# Altium schematic sheet LionIRVT-TM4C_Power.SchDoc
size A4; Date: Not shown in title block; ApprovedBy: Not shown in title block; CheckedBy: Not shown in title block; Author: Not shown in title block; CompanyName: Not shown in title block; Engineer: Not shown in title block; Organization: Not shown in title block; Address1: Not shown in title block; Address2: Not shown in title block; Address3: Not shown in title block; Address4: Not shown in title block; DocumentNumber: 11; Revision: Use project parameter SCH_Rev; SheetNumber: 11; SheetTotal: 11; PageSetup: Record=PageOptions|CenterHorizontal=True|CenterVertical=True|PrintScale=1.00|XCorrection=1.00|YCorrection=1.00|PrintKind=0|BorderSize=5000000|LeftOffset=0|BottomOffset=0|Orientation=2|PaperLength=1000|PaperWidth=1000|Scale=100|PaperSource=15|PrintQuality=600|MediaType=1|DitherType=10|PaperKind=Letter|PrintScaleMode=1; CurrentTime: Not shown in title block; CurrentDate: Not shown in title block; Time: Not shown in title block; DocumentFullPathAndName: Not shown in title block; DocumentName: Not shown in title block; ModifiedDate: Not shown in title block; ImagePath: Not shown in title block
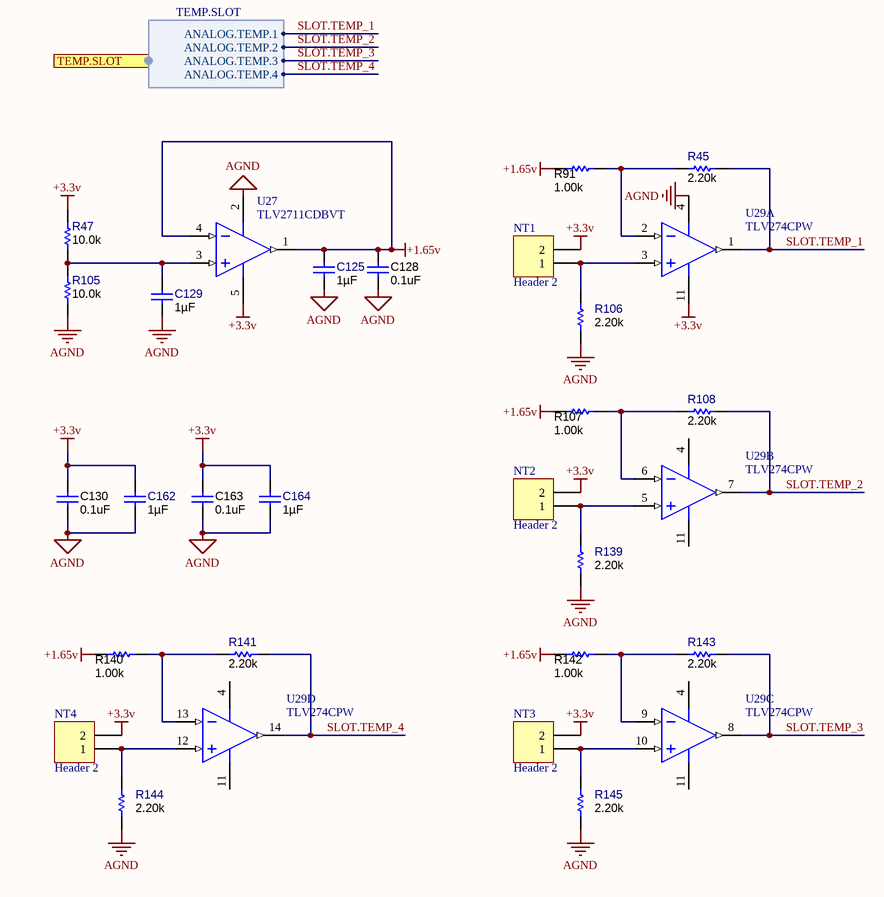
[diagram p0: LionIRVT-TM4C_Power.SchDoc]

## Parts
C125  ValueDisplayed: 1µF  [0603C]  (hidden comment: C0603C105K3RACTU)
C128  ValueDisplayed: 0.1uF  [0603C]  (hidden comment: Capacitor)
C129  ValueDisplayed: 1µF  [0603C]  (hidden comment: C0603C105K3RACTU)
C130  ValueDisplayed: 0.1uF  [0603C]  (hidden comment: Capacitor)
C162  ValueDisplayed: 1µF  [0603C]  (hidden comment: C0603C105K3RACTU)
C163  ValueDisplayed: 0.1uF  [0603C]  (hidden comment: Capacitor)
C164  ValueDisplayed: 1µF  [0603C]  (hidden comment: C0603C105K3RACTU)
NT1  Header 2  [HDR1X2]
NT2  Header 2  [HDR1X2]
NT3  Header 2  [HDR1X2]
NT4  Header 2  [HDR1X2]
R45  ValueDisplayed: 2.20k  [0603R]  (hidden comment: RC0603FR-072K2L)
R47  ValueDisplayed: 10.0k  [0603R]  (hidden comment: RC0603FR-0710KL)
R91  ValueDisplayed: 1.00k  [0603R]  (hidden comment: Resistor)
R105  ValueDisplayed: 10.0k  [0603R]  (hidden comment: RC0603FR-0710KL)
R106  ValueDisplayed: 2.20k  [0603R]  (hidden comment: RC0603FR-072K2L)
R107  ValueDisplayed: 1.00k  [0603R]  (hidden comment: Resistor)
R108  ValueDisplayed: 2.20k  [0603R]  (hidden comment: RC0603FR-072K2L)
R139  ValueDisplayed: 2.20k  [0603R]  (hidden comment: RC0603FR-072K2L)
R140  ValueDisplayed: 1.00k  [0603R]  (hidden comment: Resistor)
R141  ValueDisplayed: 2.20k  [0603R]  (hidden comment: RC0603FR-072K2L)
R142  ValueDisplayed: 1.00k  [0603R]  (hidden comment: Resistor)
R143  ValueDisplayed: 2.20k  [0603R]  (hidden comment: RC0603FR-072K2L)
R144  ValueDisplayed: 2.20k  [0603R]  (hidden comment: RC0603FR-072K2L)
R145  ValueDisplayed: 2.20k  [0603R]  (hidden comment: RC0603FR-072K2L)
U27  TLV2711CDBVT  [DBV0005A_M]
U29  TLV274CPW  [PW0014A_M]  (parts A,B,C,D of 4)

## Ports
TEMP.SLOT (harness TEMP.SLOT)

## Harnesses
TEMP.SLOT: ANALOG.TEMP.1, ANALOG.TEMP.2, ANALOG.TEMP.3, ANALOG.TEMP.4

## Nets
+1.65v: C125.2 C128.1 R91.2 R107.2 R140.2 R142.2 U27.1(OUT) U27.4(IN-)
+3.3v: C130.1 C162.2 C163.1 C164.2 NT1.2 NT2.2 NT3.2 NT4.2 R47.1 U27.5(VDD-/GND) U29.11(GND)
AGND: C125.1 C128.2 C129.1 C130.2 C162.1 C163.2 C164.1 R105.2 R106.1 R139.1 R144.1 R145.1 U27.2(VDD+) U29.4(VDD)
SLOT.TEMP_1: R45.1 U29.1(OUT1) ; port TEMP.SLOT.ANALOG.TEMP.1
SLOT.TEMP_2: R108.1 U29.7(OUT2) ; port TEMP.SLOT.ANALOG.TEMP.2
SLOT.TEMP_3: R143.1 U29.8(OUT3) ; port TEMP.SLOT.ANALOG.TEMP.3
SLOT.TEMP_4: R141.1 U29.14(OUT4) ; port TEMP.SLOT.ANALOG.TEMP.4
NetC129_2: C129.2 R47.2 R105.1 U27.3(IN+)
NetNT1_1: NT1.1 R106.2 U29.3(IN1+)
NetNT2_1: NT2.1 R139.2 U29.5(IN2+)
NetNT3_1: NT3.1 R145.2 U29.10(IN3+)
NetNT4_1: NT4.1 R144.2 U29.12(IN4+)
NetR45_2: R45.2 R91.1 U29.2(IN1-)
NetR107_1: R107.1 R108.2 U29.6(IN2-)
NetR140_1: R140.1 R141.2 U29.13(IN4-)
NetR142_1: R142.1 R143.2 U29.9(IN3-)

## Notes on the sheet
- Title
- Size:
- Date:
- A4
- Number:
- Time:
- Revision:
- Sheet
- of
- File:

## Library data of the parts
C125 C129 C162 C164 = C0603C105K3RACTU: CAP, CERM, 1 µF, 25 V, +/- 10%, X7R, 0603; Manufacturer: Kemet; Polarized: N; CompType: Capacitor; Value: 1uF; U/M: EA; Cap_F: 0.000001; Tolerance_%: 10; Value1: Unknown; VDC_V: 25; Value2: 25V; TaMin_C: -55; TaMax_C: 125; Cap_Case: 0603; SizeArea_mm2: 1.28; SizeAreaWB_mm2: 4.68; SizeX_mm: 1.6; SizeY_mm: 0.8; SizeZ_mm: 1; AEC Category: Q200; SymbolVersion: 2008-07-09; PartNumber: C0603C105K3RACTU; PackageReference: 0603; RoHS: Y; MountType: SMT; Technology: Ceramic; TempCo: X7R; Published: 2008-06-19; Publisher: Texas Instruments; LatestRevisionDate: 2016-09-23; ComponentLink1Description: Datasheet link; ComponentLink1URL: http://capacitoredge.kemet.com/capedge2/DataSheet/Datasheet-C0603C105K3RACTU.pdf?pn=C0603C105K3RACTU; Supplier 1: Digi-Key; Supplier Part Number 1: 399-7376-1-ND; Supplier 2: Mouser; Supplier Part Number 2: 80-C0603C105K3R; Supplier 3: Farnell; Supplier Part Number 3: 2118128; AEC Qualified: ?
C128 C130 C163 = CMP-0006752-5: CAP, CERM, 0.1 uF, 25 V, +/- 5%, X7R, 0603; PartNumber: 06033C104JAT2A; Manufacturer: AVX; Polarized: N; Value: 0.1uF; U/M: EA; Cap_F: 100nF; ESR_ohm: 0.05; Value1: 0.05 ohm; VDC_V: 25V; TaMin_C: -55°C; TaMax_C: 125°C; Cap_Case: 0603; AEC Category: Q200; SizeArea_mm2: 1.28; SizeAreaWB_mm2: 4.68; SizeX_mm: 1.6; SizeY_mm: 0.8; SizeZ_mm: 1; CompType: Capacitor; PackageReference: 0603; RoHS: Y; Tolerance_%: 5%; Value2: 25V; MountType: SMT; Technology: Ceramic; TempCo: X7R; Published: 2008-06-19; Publisher: Texas Instruments; LatestRevisionDate: 2017-03-09; ComponentLink1Description: Datasheet link; ComponentLink1URL: http://datasheets.avx.com/X7RDielectric.pdf; Supplier 1: Digi-Key; Supplier Part Number 1: 478-3713-1-ND; Supplier 2: Mouser; Supplier Part Number 2: 581-06033C104JAT2A; Supplier 3: Farnell; Supplier Part Number 3: 1740614; AEC Qualified: N; AEC Grade: N/A
NT1-NT4 = Header 2: Header, 2-Pin; LatestRevisionDate: 17-Jul-2002; LatestRevisionNote: Re-released for DXP Platform.; Publisher: Altium Limited
R45 R106 R108 R139 R141 R143-R145 = RC0603FR-072K2L: RES, 2.20 k, 1%, 0.1 W, 0603; Manufacturer: Yageo America; CompType: Resistor; Value: 2.20k; Res_ohm: 2200; Value_Code: 2k20; Tolerance_%: 1; Power_W: 0.1; Value2: 0.1W; VDC_V: 150; TempCo: 200 ppm/C; SizeArea_mm2: 1.28; SizeX_mm: 1.6; SizeY_mm: 0.8; U/M: EA; AEC Category: Q200; SymbolVersion: 2009-05-29; PartNumber: RC0603FR-072K2L; PackageReference: 0603; RoHS: Y; Value1: 1%; MountType: SMT; Technology: Thick Film; SizeZ_mm: 1; Published: 2008-06-26; Publisher: Texas Instruments; LatestRevisionDate: 2017-03-04; ComponentLink1Description: Datasheet link; ComponentLink1URL: http://www.yageo.com/pdf/Pu-RC0603_51_PbFree_L_2.pdf; Supplier 1: Digi-Key; Supplier Part Number 1: 311-2.20KHRCT-ND; Supplier 2: Mouser; Supplier Part Number 2: 603-RC0603FR-072K2L; Supplier 3: Farnell; Supplier Part Number 3: 9238522; AEC Qualified: ?
R47 R105 = RC0603FR-0710KL: RES, 10.0 k, 1%, 0.1 W, 0603; Manufacturer: Yageo America; CompType: Resistor; Value: 10.0k; Res_ohm: 10000; Value_Code: 10k0; Tolerance_%: 1; Power_W: 0.1; Value2: 0.1W; VDC_V: 150; TempCo: 200 ppm/C; SizeArea_mm2: 1.28; SizeX_mm: 1.6; SizeY_mm: 0.8; EIA_Code: E96; U/M: EA; AEC Category: Q200; SymbolVersion: 2009-05-29; PartNumber: RC0603FR-0710KL; PackageReference: 0603; RoHS: Y; Value1: 1%; MountType: SMT; Technology: Thick Film; SizeZ_mm: 1; Published: 2008-06-26; Publisher: Texas Instruments; LatestRevisionDate: 2017-03-04; ComponentLink1Description: Datasheet link; ComponentLink1URL: http://www.yageo.com/pdf/Pu-RC0603_51_PbFree_L_2.pdf; Supplier 1: Digi-Key; Supplier Part Number 1: 311-10.0KHRCT-ND; Supplier 2: Mouser; Supplier Part Number 2: 603-RC0603FR-0710KL; Supplier 3: Farnell; Supplier Part Number 3: 9238603; AEC Qualified: ?
R91 R107 R140 R142 = CMP-0022109-5: RES, 1.00 k, 1%, 0.1 W, AEC-Q200 Grade 0, 0603; PartNumber: CRCW06031K00FKEA; Manufacturer: Vishay-Dale; Value: 1.00k; Res_ohm: 1k; Value_Code: 1k00; Power_W: 100mW; Value2: 0.1W; VDC_V: 75V; TempCo: 100 ppm/C; EIA_Code: E96; AEC Category: Q200; AEC Qualified: Y; AEC Grade: 0; SizeArea_mm2: 1.28; SizeX_mm: 1.6; SizeY_mm: 0.8; SizeZ_mm: 1; CompType: Resistor; PackageReference: 0603; RoHS: E; Tolerance_%: 1%; Value1: 1%; MountType: SMT; Technology: Thick Film; ComponentLink1Description: Datasheet link; ComponentLink1URL: http://www.vishay.com/docs/20035/dcrcwe3.pdf; Supplier 1: Digi-Key; Supplier Part Number 1: 541-1.00KHCT-ND; Supplier 2: Newark; Supplier Part Number 2: 52K8015; Supplier 3: Mouser; Supplier Part Number 3: 71-CRCW0603-1.0K-E3
U27 = CMP-0271-00232-3: Single LinCMOS(TM) Rail-to-Rail uPower Operational Amplifier, 2.7 to 10 V, 0 to 70 degC, 5-pin SOT23 (DBV5), Green (RoHS & no Sb/Br); Manufacturer: Texas Instruments; Sub Family: Low Power Amp (<=500uA), Low Supply Voltage Amplifier (<=2.7V), Precision Amplifier; Total Supply Voltage(Min)(+5V is 5, +/-5V is 10): 2.7; Total Supply Voltage(Max)(+5V is 5, +/-5V is 10): 10; Slew Rate(Typ)(V/us): 0.025; Vio (25C)(Max)(mV): 3; IIB(Max)(pA): 60; Offset Drift(Typ)(uV/C): 1; CMRR(Min)(dB): 65; Vn at 1kHz(Typ)(nV/rtHz): 22; PackageVersion: 4073253-4/K, 03/2006; PackageDescription: 5-Pin Plastic Small Outline, Body 1.6 x 2.9 mm, Pitch 0.95 mm; DatasheetVersion: SLOS196A; ComponentLink3URL: http://www.ti.com/litv/pdf/mpds018i; Eco-Plan: Green (RoHS & no Sb/Br); ComponentLink2Description: Datasheet; ComponentLink2URL: http://www.ti.com/general/docs/lit/getliterature.tsp?genericPartNumber=TLV2711&fileType=pdf; PartNumber: TLV2711CDBVT; PackageReference: DBV0005A; Code_JEDEC: MO-178; Mounting Technology: Surface Mount; Iq per channel(Max)(mA): 0.025; ComponentLink1Description: Manufacturer URL; ComponentLink3Description: Package Specification; Number of Channels: 1; ComponentLink1URL: http://www.ti.com/
U29 = CMP-0272-04009-3: 550 uA/Ch, 3 MHz, Rail-to-Rail Output Operational Amplifier, 2.7 to 16 V, 0 to 70 degC, 14-pin SOP (PW14), Green (RoHS & no Sb/Br); Manufacturer: Texas Instruments; IIB(Max)(pA): 60; Total Supply Voltage(Min)(+5V is 5, +/-5V is 10): 2.7; Packing: TUBE; Offset Drift(Typ)(uV/C): 2; Slew Rate(Typ)(V/us): 2.4; Rating: Catalog; Iq per channel(Max)(mA): 0.55; Vio (25C)(Max)(mV): 5; GBW(Typ)(MHz): 3; CMRR(Min)(dB): 69; Sub Family: Low Supply Voltage Amplifier (<=2.7V), Precision Amplifier; Total Supply Voltage(Max)(+5V is 5, +/-5V is 10): 16; Number of Channels: 4; ComponentLink3URL: http://www.ti.com/litv/pdf/mpds360; PackageReference: PW0014A; Eco-Plan: Green (RoHS & no Sb/Br); DatasheetVersion: SLOS351D; PartNumber: TLV274CPW; Mounting Technology: Surface Mount; Code_JEDEC: MO-153; ComponentLink2Description: Datasheet; ComponentLink1Description: Manufacturer URL; PackageDescription: 14-Pin Plastic Small Outline, Body 5 x 4.4 mm, Pitch 0.65 mm; ComponentLink1URL: http://www.ti.com/; ComponentLink3Description: Package Specification; ComponentLink2URL: http://www.ti.com/lit/ds/symlink/tlv274.pdf; PackageVersion: 4040064-3/G, 02/2011